# EAGLE design ContunityTestingRig (EAGLE 9.6.2)
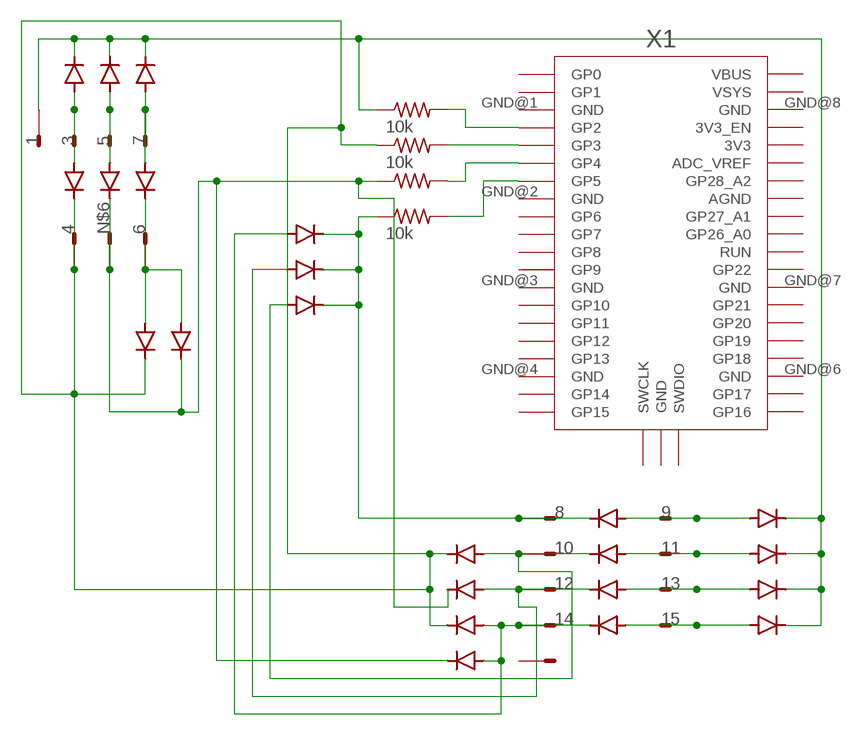
[diagram p0: schematic, sheet 1]

## Parts
D1  SCHOTTKY  DIODE_SCHOTTKY_CDBM1100-G  [MINI-SMA]
D2  SCHOTTKY  DIODE_SCHOTTKY_CDBM1100-G  [MINI-SMA]
D3  SCHOTTKY  DIODE_SCHOTTKY_CDBM1100-G  [MINI-SMA]
D4  SCHOTTKY  DIODE_SCHOTTKY_CDBM1100-G  [MINI-SMA]
D5  SCHOTTKY  DIODE_SCHOTTKY_CDBM1100-G  [MINI-SMA]
D6  SCHOTTKY  DIODE_SCHOTTKY_CDBM1100-G  [MINI-SMA]
D7  SCHOTTKY  DIODE_SCHOTTKY_CDBM1100-G  [MINI-SMA]
D8  SCHOTTKY  DIODE_SCHOTTKY_CDBM1100-G  [MINI-SMA]
D9  SCHOTTKY  DIODE_SCHOTTKY_CDBM1100-G  [MINI-SMA]
D10  SCHOTTKY  DIODE_SCHOTTKY_CDBM1100-G  [MINI-SMA]
D11  SCHOTTKY  DIODE_SCHOTTKY_CDBM1100-G  [MINI-SMA]
D12  SCHOTTKY  DIODE_SCHOTTKY_CDBM1100-G  [MINI-SMA]
D13  SCHOTTKY  DIODE_SCHOTTKY_CDBM1100-G  [MINI-SMA]
D14  SCHOTTKY  DIODE_SCHOTTKY_CDBM1100-G  [MINI-SMA]
D15  SCHOTTKY  DIODE_SCHOTTKY_CDBM1100-G  [MINI-SMA]
D16  SCHOTTKY  DIODE_SCHOTTKY_CDBM1100-G  [MINI-SMA]
D17  SCHOTTKY  DIODE_SCHOTTKY_CDBM1100-G  [MINI-SMA]
D18  SCHOTTKY  DIODE_SCHOTTKY_CDBM1100-G  [MINI-SMA]
D19  SCHOTTKY  DIODE_SCHOTTKY_CDBM1100-G  [MINI-SMA]
D20  SCHOTTKY  DIODE_SCHOTTKY_CDBM1100-G  [MINI-SMA]
D21  SCHOTTKY  DIODE_SCHOTTKY_CDBM1100-G  [MINI-SMA]
D22  SCHOTTKY  DIODE_SCHOTTKY_CDBM1100-G  [MINI-SMA]
D23  SCHOTTKY  DIODE_SCHOTTKY_CDBM1100-G  [MINI-SMA]
R1  10k  R1206FAB  [R1206FAB]
R2  10k  R1206FAB  [R1206FAB]
R3  10k  R1206FAB  [R1206FAB]
R4  10k  R1206FAB  [R1206FAB]
SV1  16E  [16P]
X1  RPI_PICO_IG-SMD  [RPI_PICO]

## Nets
1: D1.KATHODE D2.KATHODE D3.KATHODE D13.KATHODE D14.KATHODE D15.KATHODE D16.KATHODE R1.1 SV1.1
3: D1.ANODE D4.ANODE SV1.3
4: D4.KATHODE D7.KATHODE D17.KATHODE D18.KATHODE R2.1 SV1.2
5: D2.ANODE D5.ANODE SV1.5
6: D6.KATHODE D7.ANODE D8.ANODE SV1.6
7: D3.ANODE D6.ANODE SV1.7
8: D9.KATHODE D21.KATHODE D22.KATHODE D23.KATHODE R4.1 SV1.8
9: D9.ANODE D13.ANODE SV1.9
10: D10.KATHODE D17.ANODE D23.ANODE SV1.10
11: D10.ANODE D14.ANODE SV1.11
12: D11.KATHODE D19.ANODE D22.ANODE SV1.12
13: D11.ANODE D15.ANODE SV1.13
14: D12.KATHODE D18.ANODE D20.ANODE D21.ANODE SV1.14
15: D12.ANODE D16.ANODE SV1.15
N$1: R1.2 X1.GP2
N$2: R2.2 X1.GP3
N$3: R3.2 X1.GP4
N$4: R4.2 X1.GP5
N$6: D5.KATHODE D8.KATHODE D19.KATHODE D20.KATHODE R3.1 SV1.4
Unconnected: SV1.16 X1.3V3 X1.3V3_EN X1.ADC_VREF X1.AGND X1.GND@1(GND) X1.GND@2(GND) X1.GND@3(GND) X1.GND@4(GND) X1.GND@5(GND) X1.GND@6(GND) X1.GND@7(GND) X1.GND@8(GND) X1.GP0 X1.GP1 X1.GP6 X1.GP7 X1.GP8 X1.GP9 X1.GP10 X1.GP11 X1.GP12 X1.GP13 X1.GP14 X1.GP15 X1.GP16 X1.GP17 X1.GP18 X1.GP19 X1.GP20 X1.GP21 X1.GP22 X1.GP26_A0 X1.GP27_A1 X1.GP28_A2 X1.RUN X1.SWCLK X1.SWDIO X1.VBUS X1.VSYS

## Library data of the parts
D1-D23 = eagle_fab:DIODE_SCHOTTKY_CDBM1100-G: Diode schottky 100V 1A mini-SMA as found in the fablab inventory Reverse Voltage: 100 Volts Forward Current: 1.0 Amp Maximum forward voltage: 0.85 Volts Made by Zaerc.
R1-R4 = eagle_fab:R: Resistor (US Symbol) Variants with postfix FAB are widened to allow the routing of internal traces
SV1 = con-dil:16E: DIL CABLE CONNECTOR
X1 = RaspberryPi_Pico:RPI_PICO_IG

## Board
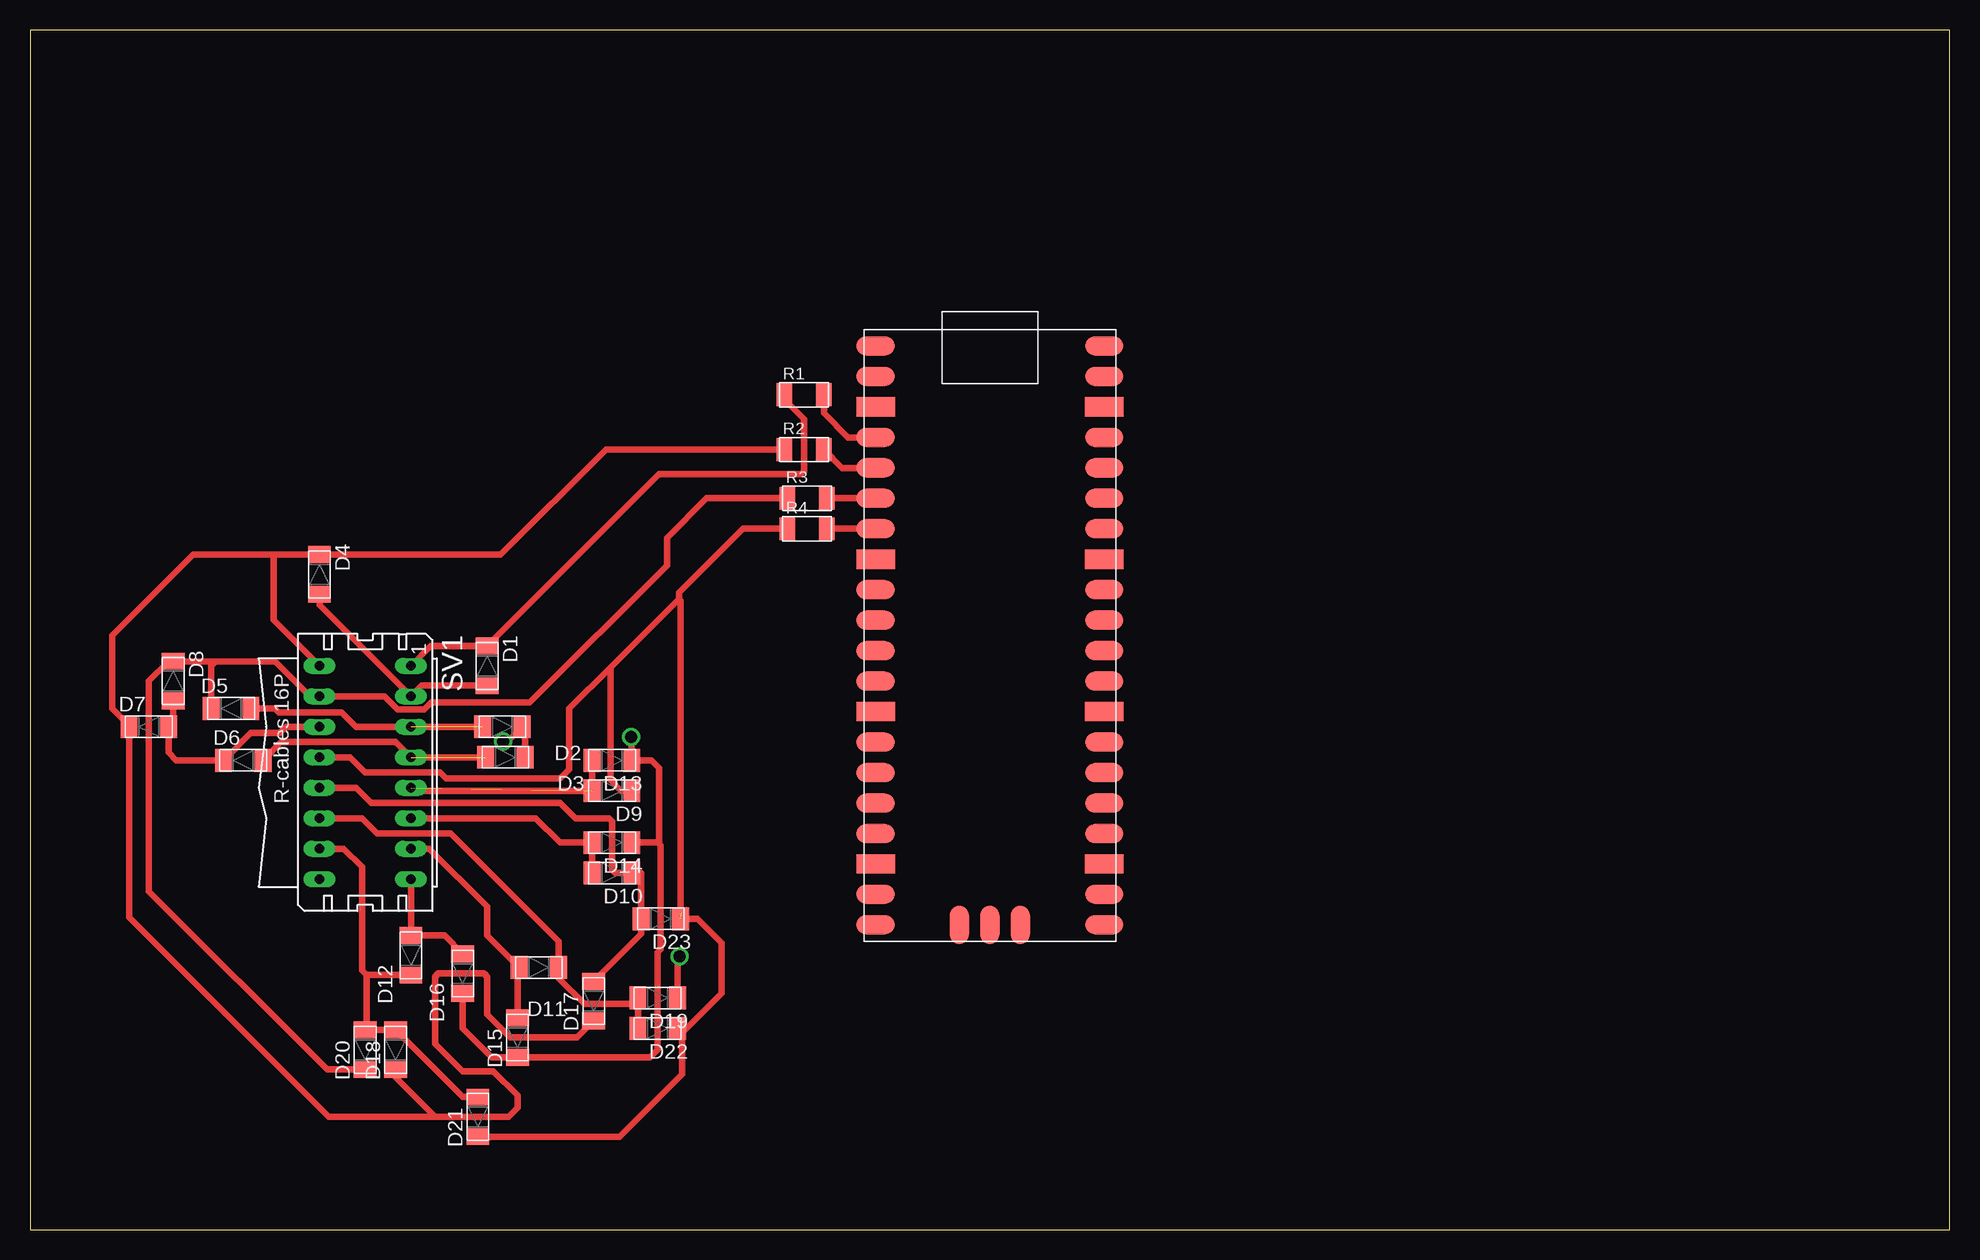
[diagram p1: board, top side]
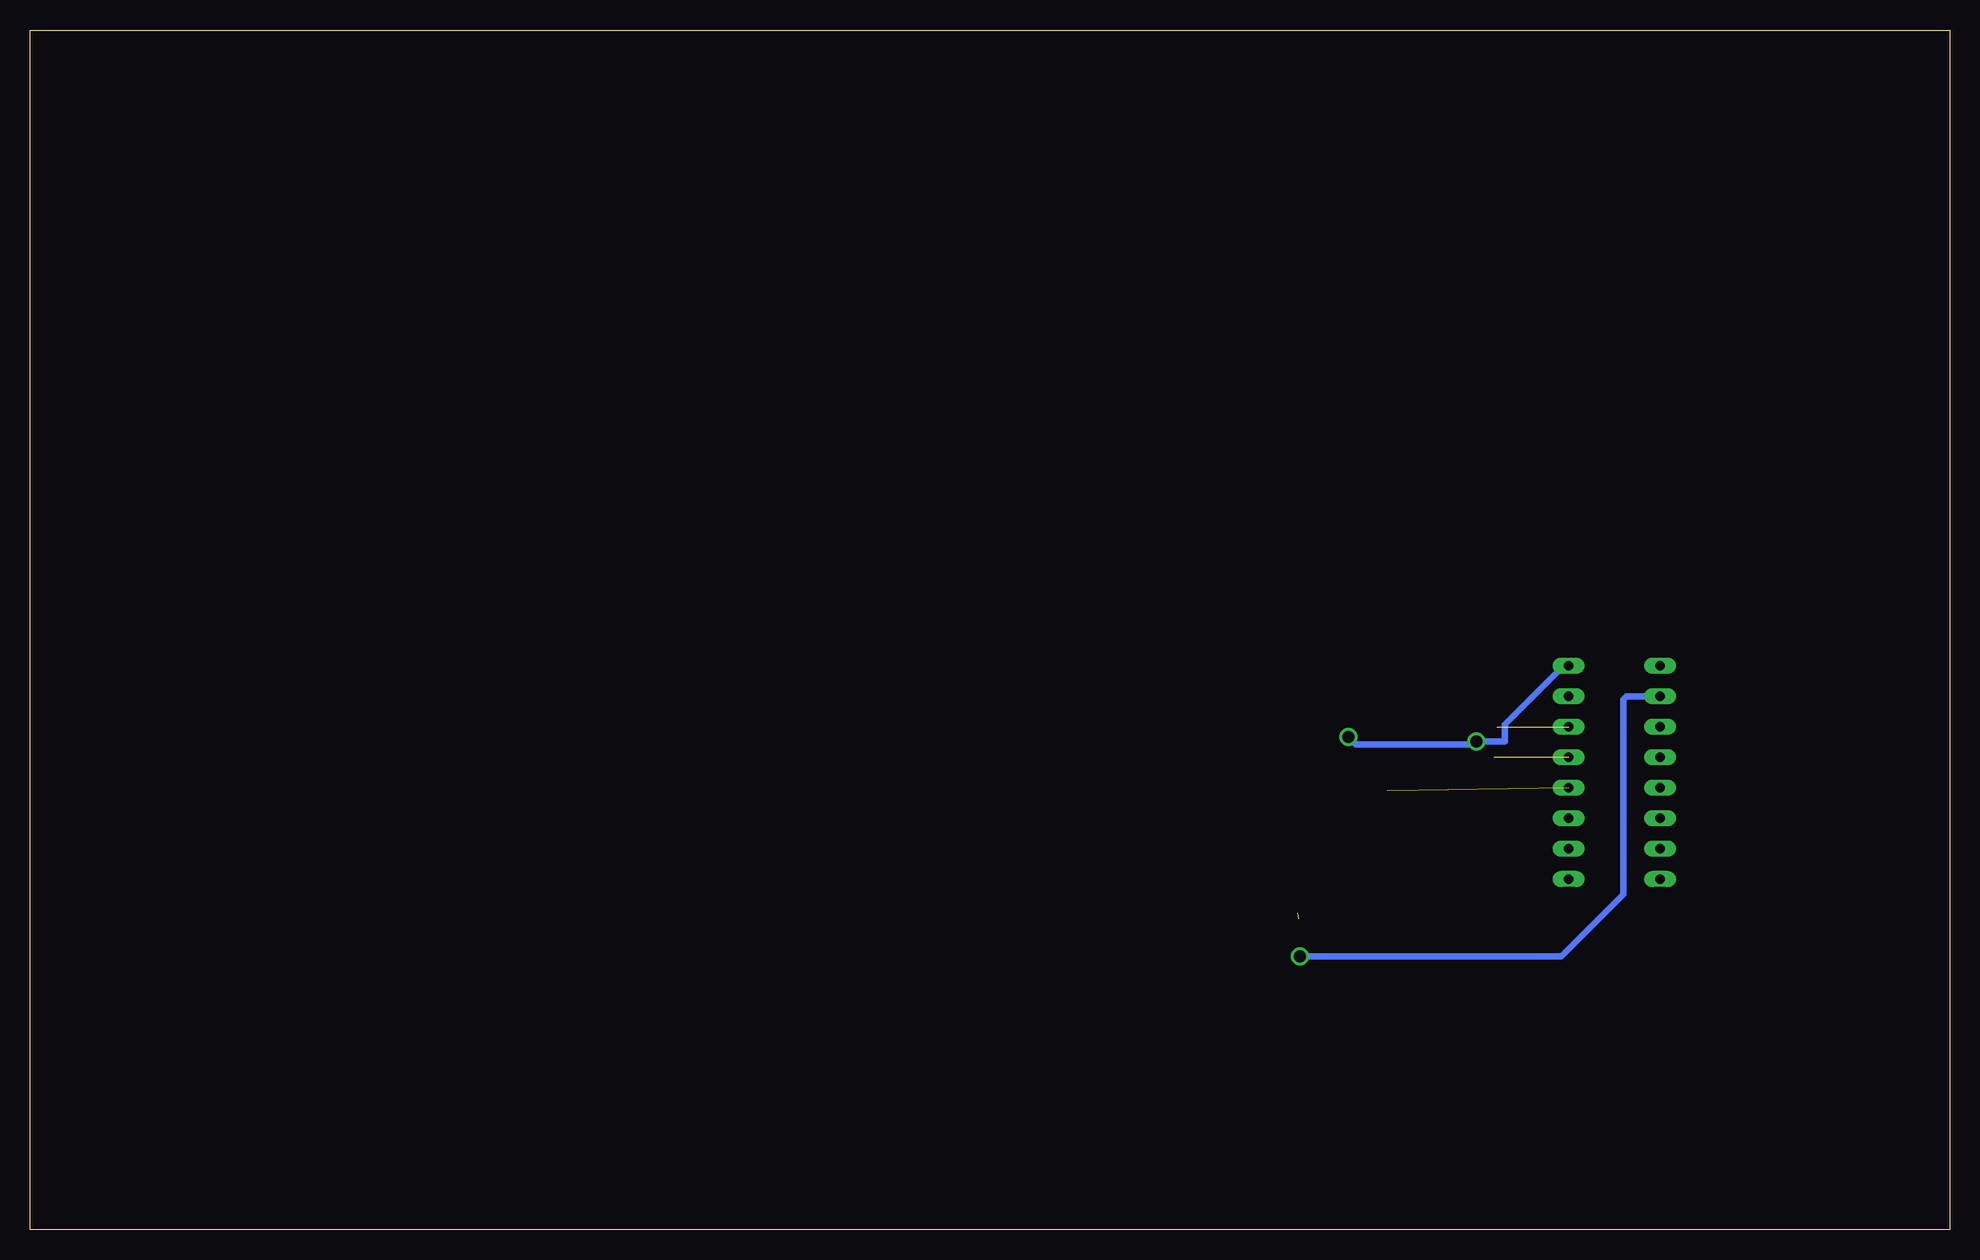
[diagram p2: board, bottom side, seen from below]

Size 160 x 100 mm. Coordinates in mm from the lower left corner, seen from the top.
Outline: 0,0 160,0 160,100 0,100 0,0
Copper layers (1*16): Top 0.035mm / dielectric 1.5mm / Bottom 0.035mm
Design rules "default *": minimum track width 6mil, minimum drill 1mm, track to track 6mil, track to pad 6mil, pad to pad 6mil, via to via 6mil, smd to smd 6mil, copper to edge 40mil, drill to drill 6mil, minimum pad ring 10mil, minimum via ring 8mil, stop-mask expansion 4mil, vias tented up to drill 0mil, thermal gap 10mil

### Footprints (pad centres in the part's own frame; a part is rotated, then mirrored left to right if it is on the bottom)
MINI-SMA = smd 1.4 x 1.9: ANODE 1.65,0; KATHODE -1.65,0
R1206FAB = smd 1.27 x 1.905: 1 -1.651,0; 2 1.651,0
16P = drill 0.813 long: 1 -8.89,3.81; 2 -8.89,-3.81; 3 -6.35,3.81; 4 -6.35,-3.81; 5 -3.81,3.81; 6 -3.81,-3.81; 7 -1.27,3.81; 8 -1.27,-3.81; 9 1.27,3.81; 10 1.27,-3.81; 11 3.81,3.81; 12 3.81,-3.81; 13 6.35,3.81; 14 6.35,-3.81; 15 8.89,3.81; 16 8.89,-3.81
RPI_PICO = smd 3.2 x 1.6: 3V3 9.525,13.97; 3V3_EN 9.525,16.51; ADC_VREF 9.525,11.43; AGND 9.525,6.35; GND@1 -9.525,19.05; GND@2 -9.525,6.35; GND@3 -9.525,-6.35; GND@4 -9.525,-19.05; GND@6 9.525,-19.05; GND@7 9.525,-6.35; GND@8 9.525,19.05; GP0 -9.525,24.13; GP1 -9.525,21.59; GP2 -9.525,16.51; GP3 -9.525,13.97; GP4 -9.525,11.43; GP5 -9.525,8.89; GP6 -9.525,3.81; GP7 -9.525,1.27; GP8 -9.525,-1.27; GP9 -9.525,-3.81; GP10 -9.525,-8.89; GP11 -9.525,-11.43; GP12 -9.525,-13.97; GP13 -9.525,-16.51; GP14 -9.525,-21.59; GP15 -9.525,-24.13; GP16 9.525,-24.13; GP17 9.525,-21.59; GP18 9.525,-16.51; GP19 9.525,-13.97; GP20 9.525,-11.43; GP21 9.525,-8.89; GP22 9.525,-3.81; GP26_A0 9.525,1.27; GP27_A1 9.525,3.81; GP28_A2 9.525,8.89; RUN 9.525,-1.27; VBUS 9.525,24.13; VSYS 9.525,21.59 | smd 1.6 x 3.2: GND@5 0,-24.13; SWCLK -2.54,-24.13; SWDIO 2.54,-24.13

### Placement (x,y rotation side)
D1  38.1,46.99 270 top
D2  39.37,41.91 180 top
D3  39.62,39.37 180 top
D4  24.13,54.61 270 top
D5  16.76,43.43 0 top
D6  17.78,39.12 0 top
D7  9.91,41.91 0 top
D8  11.94,45.72 270 top
D9  48.51,36.58 180 top
D10  48.51,29.72 180 top
D11  42.42,21.84 180 top
D12  31.75,22.86 90 top
D13  48.51,39.12 180 top
D14  48.51,32.26 180 top
D15  40.64,16 90 top
D16  36.07,21.34 90 top
D17  46.99,19.05 90 top
D18  30.48,14.99 90 top
D19  52.32,19.3 180 top
D20  27.94,14.99 90 top
D21  37.34,9.4 90 top
D22  52.32,16.76 180 top
D23  52.58,25.91 180 top
R1  64.52,69.6 0 top
R2  64.52,65.02 0 top
R3  64.77,60.96 0 top
R4  64.77,58.42 0 top
SV1  27.94,38.1 270 top
X1  80.01,49.53 0 top

### Tracks (layer width: path | path; a pad name or v marks a point on that pad's centre or on a via)
1  (via drill 1)
  Top 0.559: R1.1 62.87,69.22 64.52,67.56 64.52,63.25 64.26,62.99 52.45,62.99 D1.KATHODE 33.4,48.64 SV1.1 | D16.KATHODE 36.07,16.76 38.48,14.35 D15.KATHODE 51.69,14.35 52.32,14.99 52.32,23.11 52.58,23.37 52.58,32 52.45,32.13 | D14.KATHODE 52.32,32.26 52.45,32.13 | 52.45,32.13 52.45,38.48 51.82,39.12 D13.KATHODE 50.16,40.97 v50.09,41.05 | D3.KATHODE 41.27,41.66 D2.KATHODE 39.8,40.69 v39.42,40.69
  Bottom 0.152: 31.85,46.94 SV1.1
  Bottom 0.559: v50.09,41.05 49.48,40.44 39.67,40.44 v39.42,40.69 37.06,40.69 37.06,42.1 31.92,47.24 31.92,47.16 SV1.1
3
  Top 0.559: D4.ANODE 24.13,52.07 SV1.3 32.64,45.34 D1.ANODE
4
  Top 0.559: D17.KATHODE 45.59,16 40.03,16 38.1,17.93 38.1,21.08 37.85,21.34 34.04,21.34 33.78,21.08 33.78,15.49 36.07,13.21 38.61,13.21 40.64,11.18 40.64,10.16 39.88,9.4 33.78,9.4 | 33.78,9.4 30.48,12.7 D18.KATHODE | 20.32,56.26 13.59,56.26 6.86,49.53 6.86,43.43 8.26,42.04 D7.KATHODE 8.26,26.03 24.89,9.4 33.78,9.4 | 20.32,56.26 D4.KATHODE 39.24,56.26 48.01,65.02 R2.1 | SV1.2 20.32,50.8 20.32,56.26
5  (1 unrouted)
  Top 0.559: D2.ANODE SV1.5 27.18,41.91 25.98,43.1 20.73,43.1 20.4,43.43 D5.ANODE
6
  Top 0.559: D8.ANODE 11.94,42.29 D7.ANODE 11.56,39.75 12.19,39.12 D6.KATHODE 18.42,41.4 20.83,41.4 21.34,41.91 SV1.6
7  (1 unrouted)
  Top 0.559: D6.ANODE 20.95,40.64 30.48,40.64 SV1.7 D3.ANODE
8  (1 unrouted)
  Top 0.152: 54.71,26.82 54.3,26.42
  Top 0.559: D21.KATHODE 49.15,7.75 54.36,12.95 54.36,16.38 | 54.36,16.38 D22.KATHODE | SV1.8 26.67,39.37 27.94,38.1 34.19,38.1 34.7,37.59 44.2,37.59 44.96,38.35 44.96,43.43 48.39,46.86 | 48.39,46.86 54.1,52.58 | 54.1,52.58 54.1,53.09 59.44,58.42 R4.1 | 54.1,52.58 54.23,52.45 D23.KATHODE 55.63,25.91 57.66,23.88 57.66,19.68 54.36,16.38 | D9.KATHODE 49.28,36.58 48.39,37.47 48.39,46.86
9  (1 unrouted)
  Top 0.559: SV1.9 32,36.58 D9.ANODE D13.ANODE
10
  Top 0.559: D17.ANODE 50.93,24.64 D23.ANODE 50.93,29.72 D10.KATHODE 48.77,29.72 48.51,29.97 48.51,34.04 48.26,34.29 45.47,34.29 44.2,35.56 28.45,35.56 27.18,36.83 SV1.10
11
  Top 0.559: SV1.11 42.16,34.29 44.2,32.26 D14.ANODE D10.ANODE
12
  Top 0.559: D22.ANODE D19.ANODE 50.17,18.8 46.23,18.8 44.07,20.96 D11.KATHODE 44.07,24 35.05,33.02 28.96,33.02 27.69,34.29 SV1.12
13
  Top 0.559: D15.ANODE 40.64,21.72 D11.ANODE 38.1,24.51 38.1,26.92 33.27,31.75 SV1.13
14
  Top 0.559: D21.ANODE 36.07,11.05 D18.ANODE D20.ANODE 28.07,16.76 28.07,21.21 | SV1.14 26.16,31.75 27.69,30.23 27.69,21.59 28.07,21.21 | 28.07,21.21 D12.KATHODE
15
  Top 0.559: D16.ANODE 34.54,24.51 D12.ANODE SV1.15
N$1
  Top 0.559: X1.GP2 68.2,66.04 66.17,68.07 R1.2
N$2
  Top 0.559: X1.GP3 67.69,63.5 R2.2
N$3
  Top 0.559: R3.2 X1.GP4
N$4
  Top 0.559: R4.2 X1.GP5
N$6  (via drill 1)
  Top 0.559: 15.49,47.37 20.45,47.37 23.37,44.45 SV1.4 29.55,44.45 30.64,43.36 32.86,43.36 33.45,43.94 41.66,43.94 53.09,55.37 53.09,57.66 56.39,60.96 R3.1 | 15.49,47.37 D8.KATHODE 11.56,47.37 9.91,45.72 9.91,28.19 24.76,13.34 D20.KATHODE | D5.KATHODE 15.11,46.99 15.49,47.37 | D19.KATHODE 53.97,22.58 v54.15,22.76
  Bottom 0.559: v54.15,22.76 32.36,22.76 27.18,27.94 27.18,44.2 26.92,44.45 SV1.4